# Altium schematic sheet TempGun - new.SchDoc
size A4
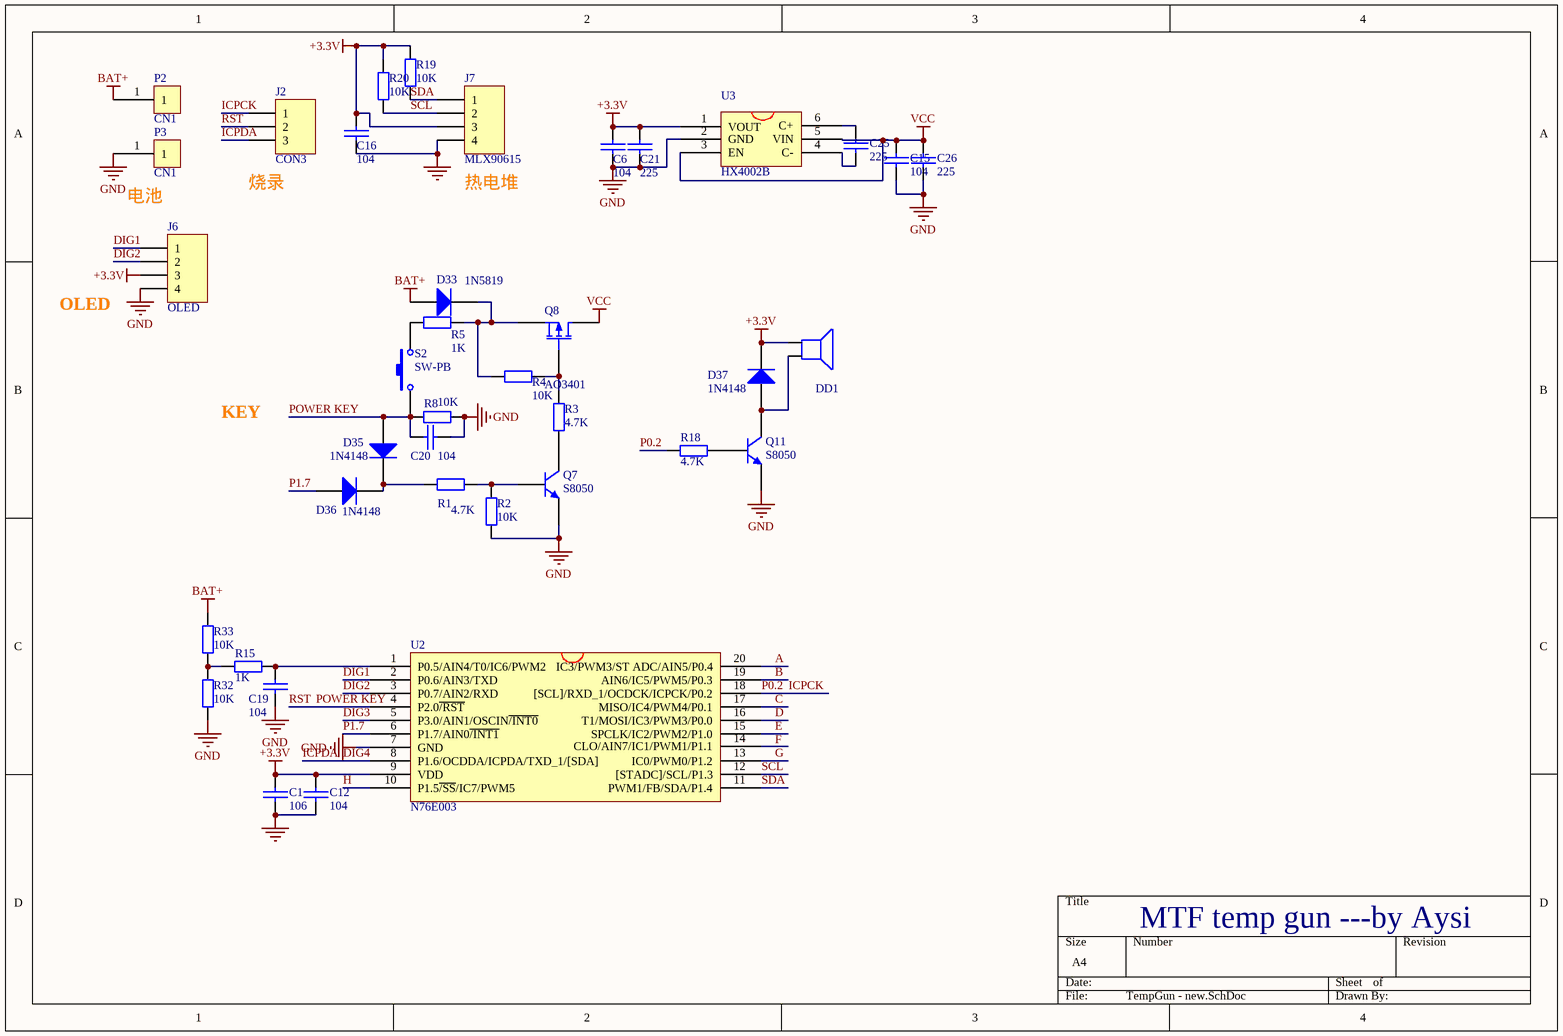
[diagram p0: TempGun - new.SchDoc]

## Parts
C1  106  [0603]
C6  104  [0603]
C12  104  [0603]
C15  104  [0603]
C16  104  [0603]
C19  104  [0603]
C20  104  [0603]
C21  225  [0603]
C25  225  [0603]
C26  225  [0603]
D33  1N5819  [SOT-323]
D35  1N4148  [SOT-323]
D36  1N4148  [SOT-323]
D37  1N4148  [SOT-323]
DD1  +5VDD  [8530]  (value not drawn)
J2  CON3  [HDR1X3]
J6  OLED  [HDR1X4]
J7  MLX90615  [HDR1X4]
P2  CN1  [1PIN]
P3  CN1  [1PIN]
Q7  S8050  [SOT-23-3]
Q8  AO3401  [SOT-23-3]
Q11  S8050  [SOT-23-3]
R1  4.7K  [0603]
R2  10K  [0603]
R3  4.7K  [0603]
R4  10K  [0603]
R5  1K  [0603]
R8  10K  [0603]
R15  1K  [0603]
R18  4.7K  [0603]
R19  10K  [0603]
R20  10K  [0603]
R32  10K  [0603]
R33  10K  [0603]
S2  SW-PB  [SW-4-SMD]
U2  N76E003  [TSSOP-20]
U3  HX4002B  [SOT-23-6]

## Nets
+3.3V: C1.1 C6.1 C12.1 C16.1 C21.1 D37.2(K) DD1.1 J6.3 J7.3 R19.2 R20.2 U2.9(VDD) U3.1(VOUT)
BAT+: D33.1(A) P2.1 R33.2
GND: C1.2 C6.2 C12.2 C15.2 C16.2 C19.2 C20.1 C21.2 C26.2 J6.4 J7.4 P3.1 Q7.3(E) Q11.3(E) R2.1 R8.1 R32.1 U2.7(GND) U3.2(GND)
VCC: C15.1 C26.1 Q8.1(D) U3.3(EN) U3.5(VIN)
A: U2.20(IC3/PWM3/ST_ADC/AIN5/P0.4)
B: U2.19(AIN6/IC5/PWM5/P0.3)
C: U2.17(MISO/IC4/PWM4/P0.1)
D: U2.16(T1/MOSI/IC3/PWM3/P0.0)
DIG1: J6.1 U2.2(P0.6/AIN3/TXD)
DIG2: J6.2 U2.3(P0.7/AIN2/RXD)
DIG3: U2.5(P3.0/AIN1/OSCIN~{/INT0})
DIG4: J2.3 U2.8(P1.6/OCDDA/ICPDA/TXD_1/[SDA])  [also labelled ICPDA]
E: U2.15(SPCLK/IC2/PWM2/P1.0)
G: U2.13(IC0/PWM0/P1.2)
H: U2.10(P1.5~{/SS}/IC7/PWM5)
ICPCK: J2.1 R18.1 U2.18([SCL]/RXD_1/OCDCK/ICPCK/P0.2)  [also labelled P0.2]
P1.7: D36.1(A) U2.6(P1.7/AIN0~{/INT1})
POWER KEY: C20.2 D35.1(A) J2.2 R8.2 S2.2 U2.4(P2.0~{/RST})  [also labelled RST]
SCL: J7.2 R20.1 U2.12([STADC]/SCL/P1.3)
SDA: J7.1 R19.1 U2.11(PWM1/FB/SDA/P1.4)
NetC19_1: C19.1 R15.2 U2.1(P0.5/AIN4/T0/IC6/PWM2)
NetC25_1: C25.1 U3.4(C-)
NetC25_2: C25.2 U3.6(C+)
NetD33_2: D33.2(K) Q8.3(S) R4.1 R5.2
NetD35_2: D35.2(K) D36.2(K) R1.1
NetD37_1: D37.1(A) DD1.2 Q11.1(C)
NetQ7_1: Q7.1(C) R3.1
NetQ7_2: Q7.2(B) R1.2 R2.2
NetQ8_2: Q8.2(G) R3.2 R4.2
NetQ11_2: Q11.2(B) R18.2
NetR5_1: R5.1 S2.1
NetR15_1: R15.1 R32.2 R33.1

Not connected (* = marked no-connect by the designer): U2 14(CLO/AIN7/IC1/PWM1/P1.1)

## Notes on the sheet
- 电池
- (near J2) 烧录
- (near J7) 热电堆
- OLED
- KEY
- MTF temp gun ---by Aysi
- Labels drawn without touching a wire or pin: F

## Library data of the parts
C1 C12 = CAP
C6 = CAP: Capacitor
C15 C16 C19-C21 C25 C26 = CAP_W
D33 D35-D37 = Diode: Default Diode; Published: 8-Jun-2000; LatestRevisionDate: 17-Jul-2002; LatestRevisionNote: Re-released for DXP Platform.; PackageVersion: Sep-1996; PackageReference: SMC; Publisher: Altium Limited; Code_JEDEC: DO-214-AB
DD1 = Pro58.tmp_UnNamed_18
J2 = Header 3: Header, 3-Pin; LatestRevisionDate: 17-Jul-2002; LatestRevisionNote: Re-released for DXP Platform.; Publisher: Altium Limited
J6 J7 = Header 4: Header, 4-Pin; LatestRevisionDate: 17-Jul-2002; LatestRevisionNote: Re-released for DXP Platform.; Publisher: Altium Limited
Q7 Q11 = NPN: NPN Bipolar Transistor; Published: 8-Jun-2000; LatestRevisionDate: 17-Jul-2002; LatestRevisionNote: Re-released for DXP Platform.; PackageReference: TO-226; Publisher: Altium Limited; Code_JEDEC: TO-226-AA
Q8 = MOSFET-P: P-Channel MOSFET; Published: 8-Jun-2000; LatestRevisionDate: 17-Jul-2002; LatestRevisionNote: Re-released for DXP Platform.; PackageVersion: 1995/1996; PackageReference: E3; Publisher: Altium Limited
R1-R4 R8 R32 R33 = Res2: Resistor; Value: 1K; Published: 8-Jun-2000; LatestRevisionDate: 17-Jul-2002; LatestRevisionNote: Re-released for DXP Platform.; PackageReference: AXIAL-0.4; Publisher: Altium Limited; PackageDescription: Axial Device, Thru-Hole; 2 Leads; 0.4 in Pin Spacing
R5 R15 = Res2: Resistor; Published: 8-Jun-2000; LatestRevisionDate: 17-Jul-2002; LatestRevisionNote: Re-released for DXP Platform.; PackageReference: AXIAL-0.4; Publisher: Altium Limited; PackageDescription: Axial Device, Thru-Hole; 2 Leads; 0.4 in Pin Spacing; Value: 1K
R18-R20 = Res2: Resistor; Value: 5.1K; Published: 8-Jun-2000; LatestRevisionDate: 17-Jul-2002; LatestRevisionNote: Re-released for DXP Platform.; PackageReference: AXIAL-0.4; Publisher: Altium Limited
S2 = SW-PB: Switch; Published: 24-Mar-1999; LatestRevisionDate: 17-Jul-2002; LatestRevisionNote: Re-released for DXP Platform.; PackageReference: SPST-2; Publisher: Altium Limited